# Altium schematic sheet Sche_MCU_IO.SchDoc
size A
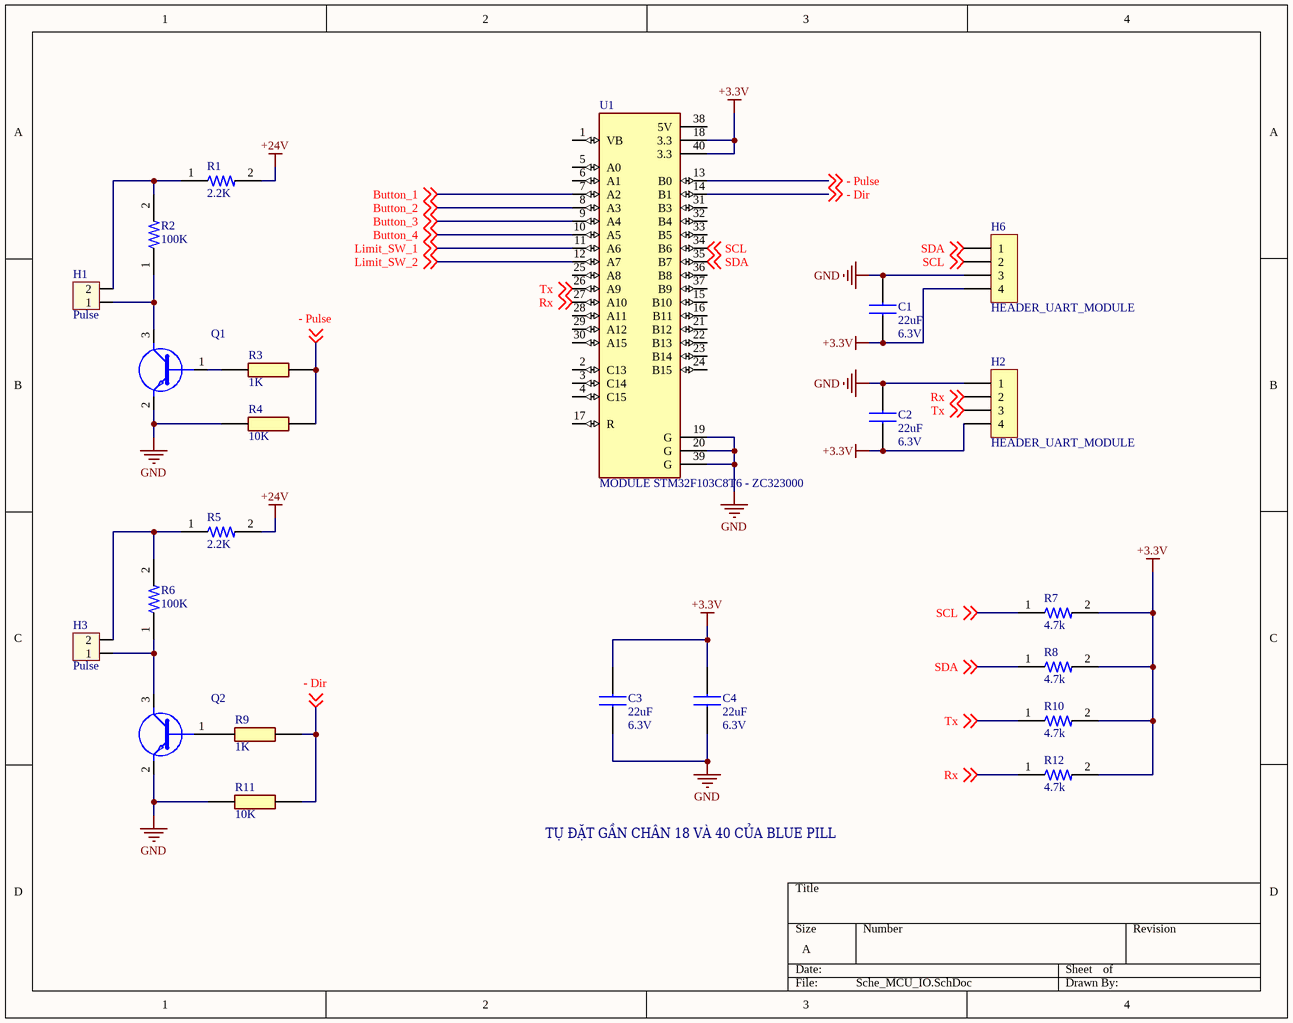
[diagram p0: Sche_MCU_IO.SchDoc]

## Parts
C1  22uF  [C 0603]
C2  22uF  [C 0603]
C3  22uF  [C 0603]
C4  22uF  [C 0603]
H1  Pulse  [Header 2P DC 2.54]
H2  HEADER_UART_MODULE  [XH2.54M-4]
H3  Pulse  [Header 2P DC 2.54]
H6  HEADER_UART_MODULE  [XH2.54M-4]
Q1  TRANS NPN 45V 0.8A SOT23-3 - BCW66GLT1G  [SOT95P237X111-3N]  (value not drawn)
Q2  TRANS NPN 45V 0.8A SOT23-3 - BCW66GLT1G  [SOT95P237X111-3N]  (value not drawn)
R1  2.2K  [RES 0805]
R2  100K  [Res 0603]
R3  1K  [ERJ3EKF1000V]
R4  10K  [ERJ3EKF1000V]
R5  2.2K  [RES 0805]
R6  100K  [Res 0603]
R7  4.7k  [Res 0603]
R8  4.7k  [Res 0603]
R9  1K  [ERJ3EKF1000V]
R10  4.7k  [Res 0603]
R11  10K  [ERJ3EKF1000V]
R12  4.7k  [Res 0603]
U1  MODULE STM32F103C8T6 - ZC323000  [MODULE_ZC323000]

## Nets
+3.3V: C1.1 C2.1 C3.2 C4.2 H2.4 H6.4 R7.2 R8.2 R10.2 R12.2 U1.18(3.3) U1.40(3.3)
+24V: R1.2 R5.2
GND: C1.2 C2.2 C3.1 C4.1 H2.1 H6.3 Q1.2(E) Q2.2(E) R4.1 R11.1 U1.19(G) U1.20(G) U1.39(G)
- Dir: R9.2 R11.2 U1.14(B1) ; off-sheet - Dir
- Pulse: R3.2 R4.2 U1.13(B0) ; off-sheet - Pulse
Button_1: U1.7(A2) ; off-sheet Button_1
Button_2: U1.8(A3) ; off-sheet Button_2
Button_3: U1.9(A4) ; off-sheet Button_3
Button_4: U1.10(A5) ; off-sheet Button_4
Limit_SW_1: U1.11(A6) ; off-sheet Limit_SW_1
Limit_SW_2: U1.12(A7) ; off-sheet Limit_SW_2
Rx: H2.2 R12.1 U1.27(A10) ; off-sheet Rx
SCL: H6.2 R7.1 U1.34(B6) ; off-sheet SCL
SDA: H6.1 R8.1 U1.35(B7) ; off-sheet SDA
Tx: H2.3 R10.1 U1.26(A9) ; off-sheet Tx
NetH1_1: H1.1 Q1.3(C) R2.1
NetH1_2: H1.2 R1.1 R2.2
NetH3_1: H3.1 Q2.3(C) R6.1
NetH3_2: H3.2 R5.1 R6.2
NetQ1_1: Q1.1(B) R3.1
NetQ2_1: Q2.1(B) R9.1

Not connected (* = marked no-connect by the designer): U1 1(VB) 2(C13) 3(C14) 4(C15) 5(A0) 6(A1) 15(B10) 16(B11) 17(R) 21(B12) 22(B13) 23(B14) 24(B15) 25(A8) 28(A11) 29(A12) 30(A15) 31(B3) 32(B4) 33(B5) 36(B8) 37(B9) 38(5V)

## Notes on the sheet
- TỤ ĐẶT GẦN CHÂN 18 VÀ 40 CỦA BLUE PILL
- (in symbol CAP CER 22UF 6.3V X5R 0603 - GRM188R60J226MEA0D) 6.3V

## Library data of the parts
C1-C4 = CAP CER 22UF 6.3V X5R 0603 - GRM188R60J226MEA0D: CAP CER 22UF 6.3V X5R 0603; Catalog: GRM188R60J226MEA0D
H1 H3 = Header 2P 2.54 Duc Cong: Cắm; Ten_Linh_Kien: Header 2P XH2.54-2P Đực Cong; Don_Vi: Con; Ma_Hang: MH002852; Chung_Loai: Cắm
H2 H6 = Header 4P 2.54 Duc Thang: Cắm; Ten_Linh_Kien: Header 4P XH2.54-4P Đực Thẳng; Don_Vi: Con; Ma_Hang: MH001285; Chung_Loai: Cắm
Q1 Q2 = TRANS NPN 45V 0.8A SOT23-3 - BCW66GLT1G: TRANS NPN 45V 0.8A SOT23-3; Manufacturer_Name: onsemi; Geometry.Height: 1.11mm; Manufacturer_Part_Number: BCW66GLT1G; Mouser Part Number: 863-BCW66GLT1G; Mouser Price/Stock: https://www.mouser.co.uk/ProductDetail/onsemi/BCW66GLT1G?qs=R2UZ7gjkEjKs0bN2RlXbWw%3D%3D; Arrow Part Number: BCW66GLT1G; Arrow Price/Stock: https://www.arrow.com/en/products/bcw66glt1g/on-semiconductor?region=nac; Datasheet Link: http://www.onsemi.com/pub/Collateral/BCW66GLT1-D.PDF
R1 R5 = RES SMD 2.2K OHM 5% 1/2W 0805 - ERJ-P06J222V: RES SMD 2.2K OHM 5% 1/2W 0805; MF: PANASONIC; MP: ERJ-P06J222V
R2 R6 = RES SMD 100K OHM 1% 1/10W 0603 - CRCW0603100KFKEA: RES SMD 100K OHM 1% 1/10W 0603; MF: Yageo; MP: CRCW0603100KFKEA
R3 R9 = RES SMD 1K OHM 5% 1/10W 0603 - ERJ-3GEYJ102V: RES SMD 1K OHM 5% 1/10W 0603; Manufacturer_Name: Panasonic; Geometry.Height: 0.55mm; Manufacturer_Part_Number: ERJ-3GEYJ102V; Mouser Part Number: 667-ERJ-3GEYJ102V; Mouser Price/Stock: https://www.mouser.co.uk/ProductDetail/Panasonic/ERJ-3GEYJ102V?qs=66DK8nO8gJBFiTsClorqsA%3D%3D; Arrow Part Number: ERJ-3GEYJ102V; Arrow Price/Stock: https://www.arrow.com/en/products/erj-3geyj102v/panasonic?region=nac; Datasheet Link: http://docs-europe.electrocomponents.com/webdocs/13ba/0900766b813ba21b.pdf
R4 R11 = RES SMD 10K OHM 5% 1/10W 0603 - ERJ3GEYJ103V: RES SMD 10K OHM 5% 1/10W 0603; Manufacturer_Name: Panasonic; Geometry.Height: 0.55mm; Manufacturer_Part_Number: ERJ3GEYJ103V; Mouser Part Number: 667-ERJ-3GEYJ103V; Mouser Price/Stock: http://www.mouser.com/Search/ProductDetail.aspx?qs=66DK8nO8gJBWgc%252b0VNNxzg%3d%3d; Arrow Part Number: *; Arrow Price/Stock: *; Datasheet Link: http://docs-europe.electrocomponents.com/webdocs/13ba/0900766b813ba21b.pdf
R7 R8 R10 R12 = RES 4.7K OHM 1% 1/10W 0603 - RC0603FR-074K7L: RES 4.7K OHM 1% 1/10W 0603; MF: Yageo; Value: *; SnapEDA_Link: https://www.snapeda.com/parts/RC0603FR-074K7L/Yageo/view-part/473520/?ref=snap; MP: RC0603FR-074K7L; Availability: Unavailable; Price: None; Package: 0603 Yageo
U1 = MODULE STM32F103C8T6 - ZC323000: MODULE STM32F103C8T6; Package: None; MP: ZC323000; Value: *; Availability: Unavailable; Price: None